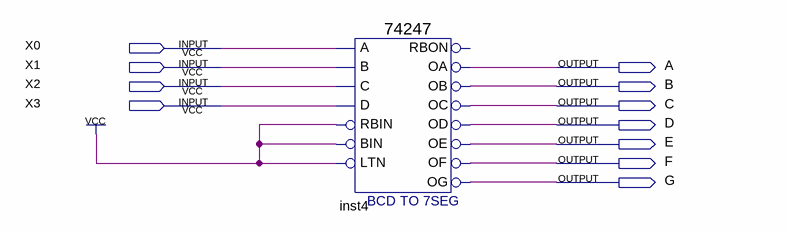
[diagram p0: schematic sheet]
// Quartus schematic lab3-1.bdf as structural Verilog: 1 symbols, 11 pins
module \lab3-1  (
  input  X0,
  input  X1,
  input  X2,
  input  X3,
  output A,
  output B,
  output C,
  output D,
  output E,
  output F,
  output G
);

  \74247  inst4 (
    .LTN(1'b1), .BIN(1'b1), .A(X0), .B(X1), .RBIN(1'b1), .C(X2), .D(X3), .OF(F), .OC(C), .OD(D), .OE(E),
    .OA(A), .OB(B), .OG(G));  // open: RBON
endmodule
